# Altium schematic sheet C-07 CPU MISC.SchDoc
size 513 x 386 mm; Address1: 350W 9th Ave; Address2: Suite 206; Address3: Escondido CA 92025; Address4: United States; Revision: -; ENG_APP_DATE: --/--/--; DSN_APP_DATE: --/--/--; CHK_APP_DATE: --/--/--
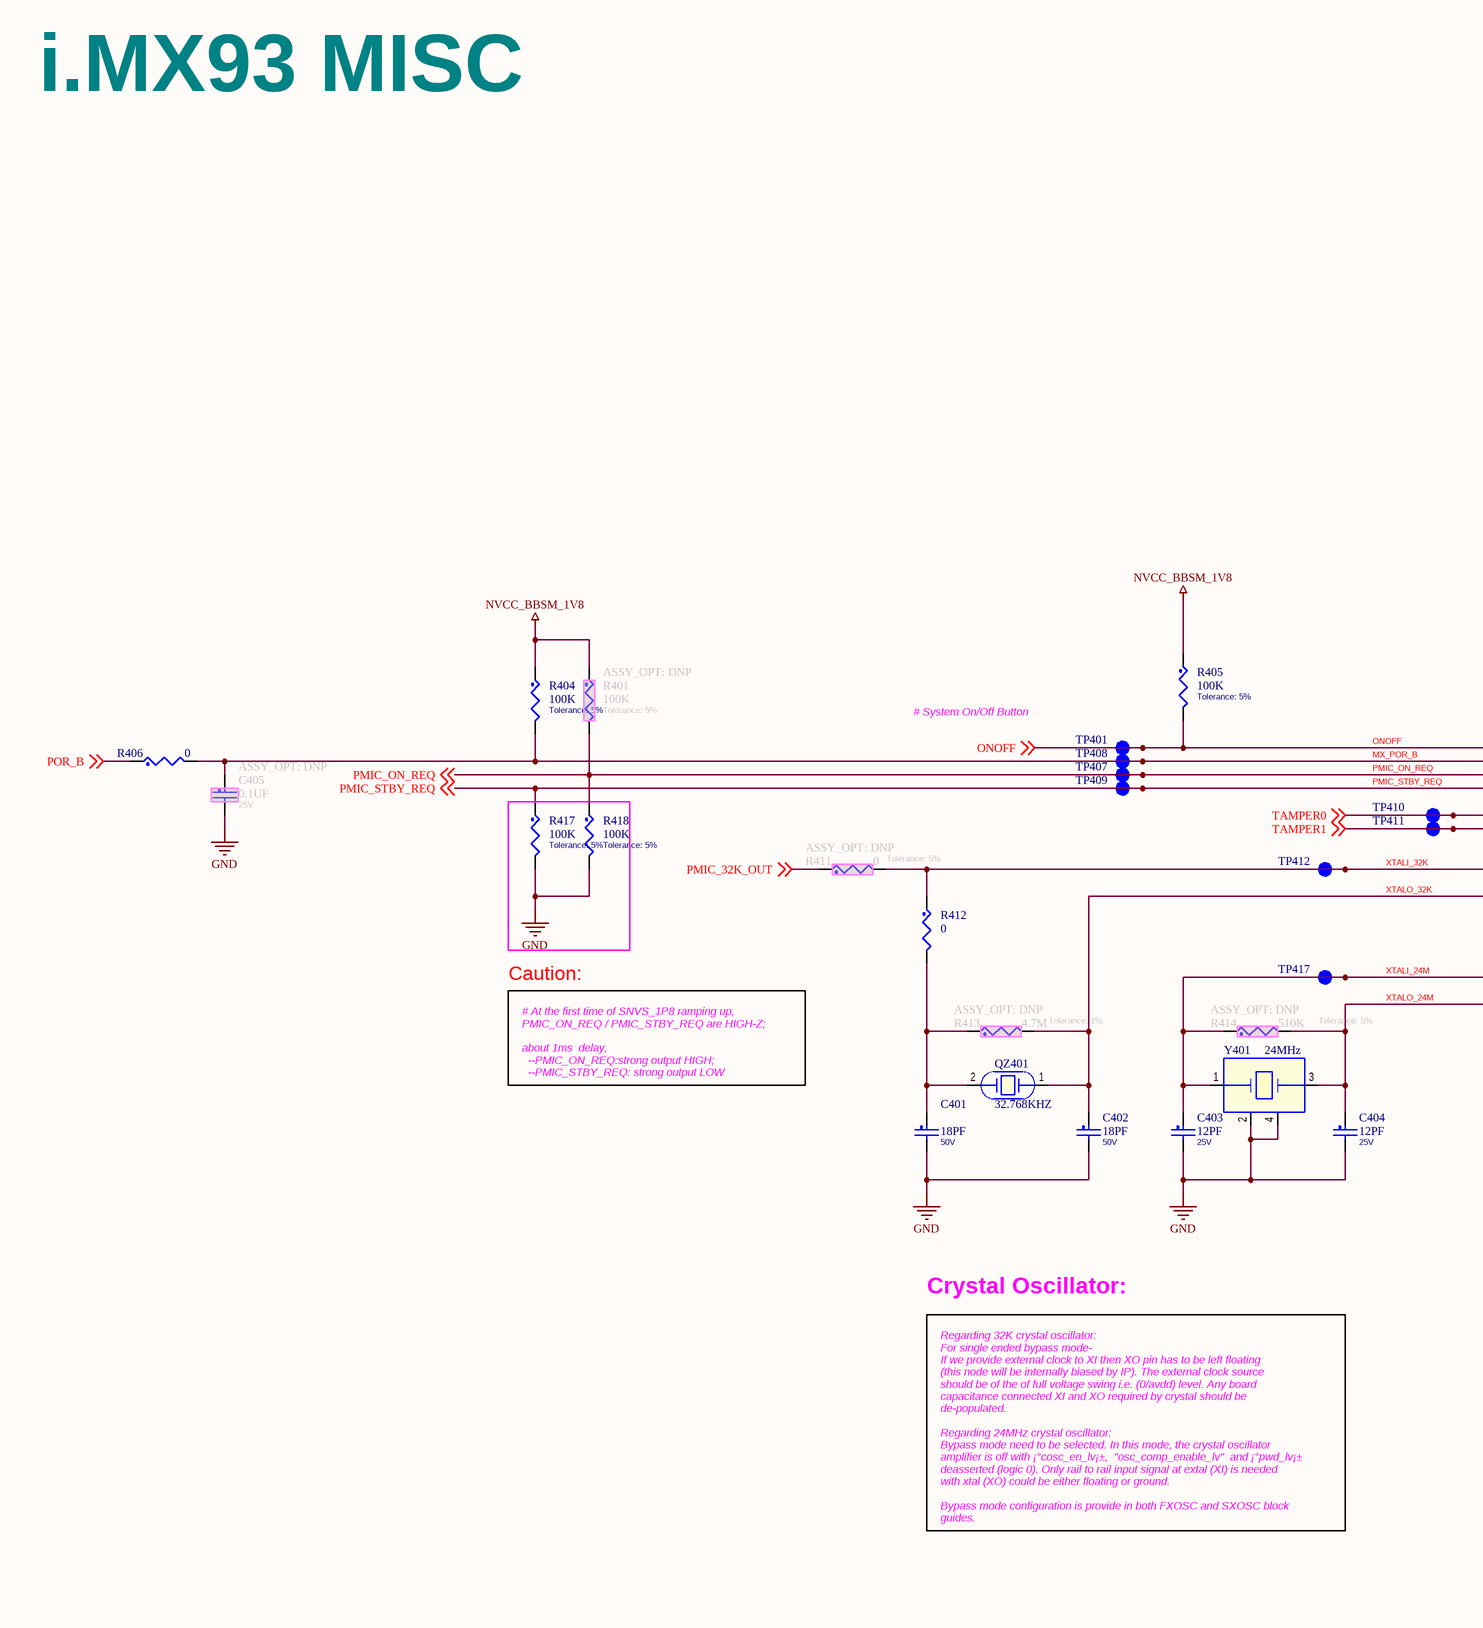
[diagram p0: C-07 CPU MISC.SchDoc, left]
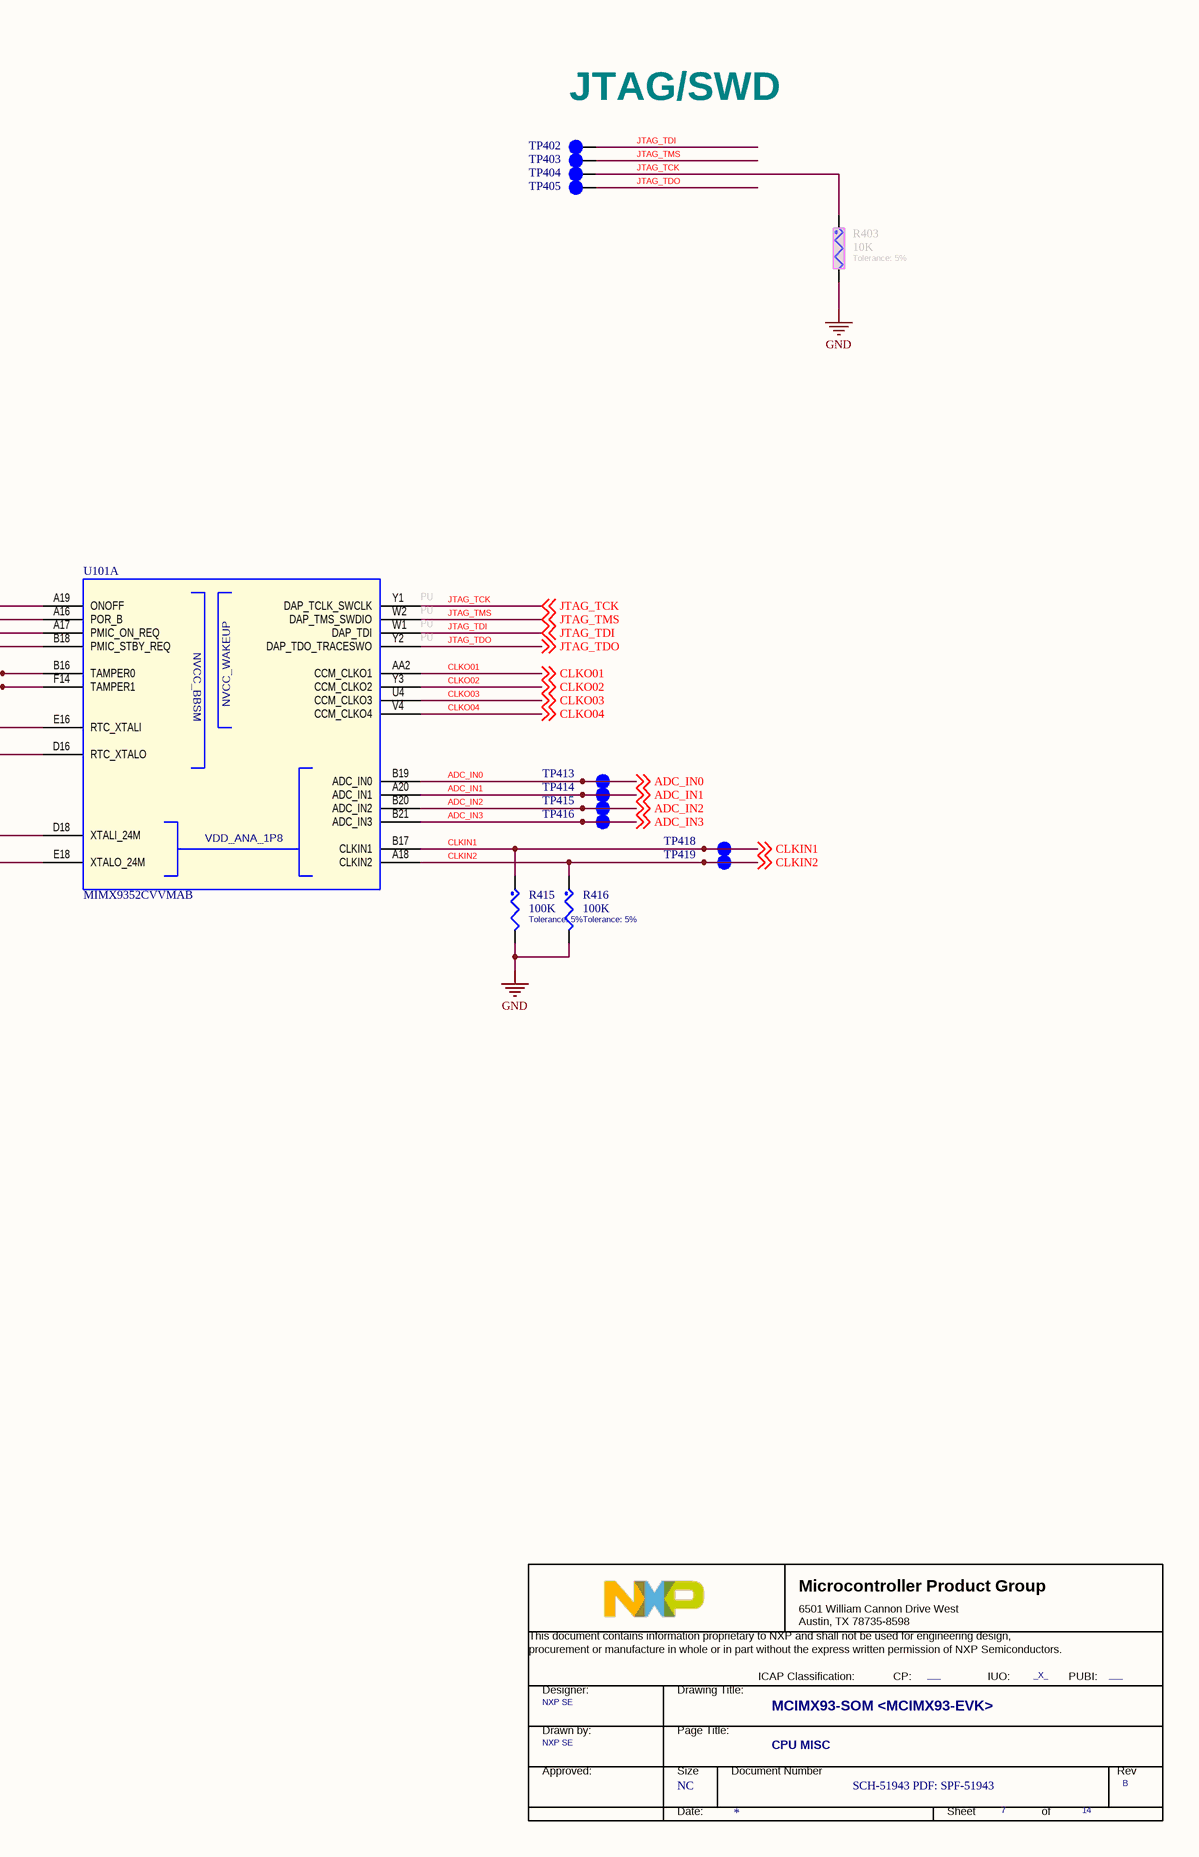
[diagram p1: C-07 CPU MISC.SchDoc, right]

## Parts
*  Doc: SCH-51943 PDF: SPF-51943  RevCode: B  Title: MCIMX93-SOM <MCIMX93-EVK>  Page Size: NC  Page Number: 7  Page Count: 14  PageTitle: CPU MISC  Designer: NXP SE  PUBI: ___  FIUO: _X_  (hidden comment: TitleBlock_MCPG)  (graphical)
C401  18PF  VOLTAGE: 50V  [0201_CC]
C402  18PF  VOLTAGE: 50V  [0201_CC]
C403  12PF  VOLTAGE: 25V  [0201_CC]
C404  12PF  VOLTAGE: 25V  [0201_CC]
C405  0.1UF  ASSY_OPT: DNP  VOLTAGE: 25V  [0402_CC]
QZ401  32.768KHZ  [XTAL2-3P2X1P5-SM]
R401  100K  ASSY_OPT: DNP  Tolerance: 5%  [0402_CC]
R403  10K  Tolerance: 5%  [0402_CC]
R404  100K  Tolerance: 5%  [0402_CC]
R405  100K  Tolerance: 5%  [0402_CC]
R406  0  [0201_CC]
R411  0  ASSY_OPT: DNP  Tolerance: 5%  [0201_CC]
R412  0  [0201_CC]
R413  4.7M  ASSY_OPT: DNP  Tolerance: 1%  [RC0402_25]
R414  510K  ASSY_OPT: DNP  Tolerance: 5%  [0402_CC]
R415  100K  Tolerance: 5%  [0402_CC]
R416  100K  Tolerance: 5%  [0402_CC]
R417  100K  Tolerance: 5%  [0402_CC]
R418  100K  Tolerance: 5%  [0402_CC]
TP401  tpad_020  [tpad_020]  (value not drawn)  (no BOM)
TP402  tpad_020  [tpad_020]  (value not drawn)  (no BOM)
TP403  tpad_020  [tpad_020]  (value not drawn)  (no BOM)
TP404  tpad_020  [tpad_020]  (value not drawn)  (no BOM)
TP405  tpad_020  [tpad_020]  (value not drawn)  (no BOM)
TP407  tpad_020  [tpad_020]  (value not drawn)  (no BOM)
TP408  tpad_020  [tpad_020]  (value not drawn)  (no BOM)
TP409  tpad_020  [tpad_020]  (value not drawn)  (no BOM)
TP410  tpad_020  [tpad_020]  (value not drawn)  (no BOM)
TP411  tpad_020  [tpad_020]  (value not drawn)  (no BOM)
TP412  TPAD_015  [TPAD_015]  (value not drawn)  (no BOM)
TP413  tpad_020  [tpad_020]  (value not drawn)  (no BOM)
TP414  tpad_020  [tpad_020]  (value not drawn)  (no BOM)
TP415  tpad_020  [tpad_020]  (value not drawn)  (no BOM)
TP416  tpad_020  [tpad_020]  (value not drawn)  (no BOM)
TP417  TPAD_015  [TPAD_015]  (value not drawn)  (no BOM)
TP418  tpad_020  [tpad_020]  (value not drawn)  (no BOM)
TP419  tpad_020  [tpad_020]  (value not drawn)  (no BOM)
U101  MIMX9352CVVMAB  [SKT_BGA306_0P5_SQ16P23_ELAST]  (part A of 6)
Y401  24MHz  [xtlosc4_3p2x2p5mm_sm]

## Nets
GND: C401.2 C402.2 C403.2 C404.2 C405.2 R403.2 R415.2 R416.2 R417.2 R418.2 Y401.2 Y401.4
NVCC_BBSM_1V8: R401.1 R404.1 R405.1
ADC_IN0: TP413.1(Pin1) U101.B19(ADC_IN0) ; off-sheet ADC_IN0
ADC_IN1: TP414.1(Pin1) U101.A20(ADC_IN1) ; off-sheet ADC_IN1
ADC_IN2: TP415.1(Pin1) U101.B20(ADC_IN2) ; off-sheet ADC_IN2
ADC_IN3: TP416.1(Pin1) U101.B21(ADC_IN3) ; off-sheet ADC_IN3
CLKIN1: R415.1 TP418.1(Pin1) U101.B17(CLKIN1) ; off-sheet CLKIN1
CLKIN2: R416.1 TP419.1(Pin1) U101.A18(CLKIN2) ; off-sheet CLKIN2
CLKO01: U101.AA2(CCM_CLKO1) ; off-sheet CLKO01
CLKO02: U101.Y3(CCM_CLKO2) ; off-sheet CLKO02
CLKO03: U101.U4(CCM_CLKO3) ; off-sheet CLKO03
CLKO04: U101.V4(CCM_CLKO4) ; off-sheet CLKO04
JTAG_TCK: R403.1 TP404.1(Pin1) U101.Y1(DAP_TCLK_SWCLK) ; off-sheet JTAG_TCK
JTAG_TDI: TP402.1(Pin1) U101.W1(DAP_TDI) ; off-sheet JTAG_TDI
JTAG_TDO: TP405.1(Pin1) U101.Y2(DAP_TDO_TRACESWO) ; off-sheet JTAG_TDO
JTAG_TMS: TP403.1(Pin1) U101.W2(DAP_TMS_SWDIO) ; off-sheet JTAG_TMS
MX_POR_B: C405.1 R404.2 R406.2 TP408.1(Pin1) U101.A16(POR_B)
ONOFF: R405.2 TP401.1(Pin1) U101.A19(ONOFF) ; off-sheet ONOFF
PMIC_32K_OUT: R411.1 ; off-sheet PMIC_32K_OUT
PMIC_ON_REQ: R401.2 R418.1 TP407.1(Pin1) U101.A17(PMIC_ON_REQ) ; off-sheet PMIC_ON_REQ
PMIC_STBY_REQ: R417.1 TP409.1(Pin1) U101.B18(PMIC_STBY_REQ) ; off-sheet PMIC_STBY_REQ
POR_B: R406.1 ; off-sheet POR_B
TAMPER0: TP410.1(Pin1) U101.B16(TAMPER0) ; off-sheet TAMPER0
TAMPER1: TP411.1(Pin1) U101.F14(TAMPER1) ; off-sheet TAMPER1
XTALI_24M: C403.1 R414.1 TP417.1(Pin1) U101.D18(XTALI_24M) Y401.1
XTALI_32K: R411.2 R412.1 TP412.1(Pin1) U101.E16(RTC_XTALI)
XTALO_24M: C404.1 R414.2 U101.E18(XTALO_24M) Y401.3
XTALO_32K: C402.1 QZ401.1 R413.2 U101.D16(RTC_XTALO)
NetC401_1: C401.1 QZ401.2 R412.2 R413.1

## Notes on the sheet
- i.MX93 MISC
- JTAG/SWD
- # System On/Off Button
- (near U101) PU
- Caution:
- # At the first time of SNVS_1P8 ramping up,
  PMIC_ON_REQ / PMIC_STBY_REQ are HIGH-Z;
  about 1ms  delay,
  --PMIC_ON_REQ:strong output HIGH;
  --PMIC_STBY_REQ: strong output LOW
- Crystal Oscillator:
- Regarding 32K crystal oscillator:
  For single ended bypass mode-
  If we provide external clock to XI then XO pin has to be left floating
  (this node will be internally biased by IP). The external clock source
  should be of the of full voltage swing i.e. (0/avdd) level. Any board
  capacitance connected XI and XO required by crystal should be
  de-populated.
  Regarding 24MHz crystal oscillator:
  Bypass mode need to be selected. In this mode, the crystal oscillator
  amplifier is off with ¡°cosc_en_lv¡±,  "osc_comp_enable_lv"  and ¡°pwd_lv¡±
  deasserted (logic 0). Only rail to rail input signal at extal (XI) is needed
  with xtal (XO) could be either floating or ground.
  Bypass mode configuration is provide in both FXOSC and SXOSC block
  guides.
- 8
- 7
- 6
- 5
- 4
- 3
- 2
- 1
- REVISION
- DESCRIPTION
- DATE
- APPROVED
- F
- E
- D
- C
- B
- PROJECT:
- REV.
- ENG:
- APPROVALS
- PROJECT
- JordanDSP LLC <https://www.jordandsp.com>
- Envision Excellence
- SHT.
- A
- DSN:
- CHK:
- REFERENCE ITEMS
- PRJ VCS REVISION:
- TITLE
- DOC VCS REVISION:
- MODIFIED DATE:
- BOM:
- FAB DWG:
- FIRMWARE:
- ASSY DWG:
- SCALE:
- SIZE
- CAGE CODE
- FILE NAME
- DWG NO.
- PAGE
- PRODUCT REV
- OF
- (in symbol MIMX9352DVNxLAA, part A) NVCC_BBSM; NVCC_WAKEUP; VDD_ANA_1P8
- (in symbol TitleBlock_MCPG) Microcontroller Product Group; 6501 William Cannon Drive West / Austin, TX 78735-8598; This document contains information proprietary to NXP and shall not be used for engineering design,; procurement or manufacture in whole or in part without the express written permission of NXP Semiconductors.; ICAP Classification:; CP:; IUO:; PUBI:; Designer:; Drawing Title:; Drawn by:; Page Title:; Approved:; Size; Document Number; Rev; Date:; Sheet; of

## Library data of the parts
* = TitleBlock_MCPG: OrgName: NXP Semiconductor; OrgAddr1: NO. 192 Liangjing Rd. Pudong New Area, ShangHai; Page Create Date: March  8, 1995; DrawnBy: NXP SE; FCP: ___; Page Modify Date: *
C401 = CAP_NP: CAP CER 18pF 50V 5% C0G 0201; CLASS: DISCRETE; FPLIST: CC0201,CC0201_HD,0201_CC; CAD_APPROVED: Yes; MFG_PN01: GRM0335C1H180JA01D; MFG_NAME01: MURATA; AGILE_PN: 150-79476; Package Type: &#966;180mm Paper taping; Package Size: 0201; HEIGHT: 0.33MM; ROHS: Yes; Tolerance: 5%; PCB Footprint: 0201_CC
C402 = CAP_NP: CAP CER 18pF 50V 5% C0G 0201; CLASS: DISCRETE; AGILE_PN: 150-79476; MFG_NAME01: MURATA; MFG_PN01: GRM0335C1H180JA01D; CAD_APPROVED: Yes; FPLIST: CC0201,CC0201_HD,0201_CC; Package Type: &#966;180mm Paper taping; Package Size: 0201; Tolerance: 5%; ROHS: Yes; HEIGHT: 0.33MM; PCB Footprint: 0201_CC
C403 C404 = CAP_NP: CAP CER 12PF 25V 5% C0G AEC-Q200 0201; CLASS: DISCRETE; AGILE_PN: 150-79813; MFG_NAME01: TDK; MFG_PN01: CGA1A2C0G1E120J030BA; CAD_APPROVED: Yes; FPLIST: CC0201,CC0201_HD,0201_CC; Tolerance: 5%; ROHS: Yes; HEIGHT: 0.33MM; PCB Footprint: 0201_CC
C405 = CAP_NP: CAP CER 0.1UF 25V 10% X5R 0402; CLASS: DISCRETE; FPLIST: CC0402_25,CC0402_HD,0402_CC; CAD_APPROVED: Yes; MFG_PN01: CC0402KRX5R8BB104; MFG_NAME01: YAGEO AMERICA; AGILE_PN: 150-78633; HEIGHT: 0.55MM; ROHS: Yes; Tolerance: 10%; Package Size: 0402; PCB Footprint: 0402_CC
QZ401 = XTAL: XTAL 32.768KHZ 12.5PF 20PPM 3.2X1.5MM SMT; CLASS: IC; AGILE_PN: 230-77653; MFG_NAME01: Abracon Corporation; MFG_PN01: ABS07-32.768KHZ-T; CAD_APPROVED: Yes; ROHS: Yes; HEIGHT: 0.9MM; PCB Footprint: XTAL2-3P2X1P5-SM
R401 R405 R415-R418 = RES: RES MF 100K 1/16W 5% 0402; CLASS: DISCRETE; Temp Range: -55C to +155C; VOLTAGE: 50V; AGILE_PN: 470-75597; MFG_NAME01: VENKEL COMPANY; MFG_PN01: CR0402-16W-104JT; CAD_APPROVED: Yes; FPLIST: RC0402_25,RC0402_HD,0402_CC; ROHS: Yes; HEIGHT: 0.40 MM; PCB Footprint: 0402_CC
R403 = RES: RES MF 10K 1/16W 5% 0402; CLASS: DISCRETE; AGILE_PN: 470-75557; MFG_NAME01: VISHAY INTERTECHNOLOGY; MFG_PN01: CRCW040210K0JNED; CAD_APPROVED: Yes; FPLIST: RC0402_25,RC0402_HD,0402_CC; PCB Footprint: 0402_CC; ROHS: Yes; HEIGHT: 0.4 MM
R404 = RES: RES MF 100K 1/16W 5% 0402; CLASS: DISCRETE; FPLIST: RC0402_25,RC0402_HD,0402_CC; CAD_APPROVED: Yes; MFG_PN01: CR0402-16W-104JT; MFG_NAME01: VENKEL COMPANY; AGILE_PN: 470-75597; VOLTAGE: 50V; Temp Range: -55C to +155C; HEIGHT: 0.40 MM; ROHS: Yes; PCB Footprint: 0402_CC
R406 R412 = RES: RES MF ZERO OHM 1/20W -- 0201; CLASS: DISCRETE; AGILE_PN: 470-76631; MFG_NAME01: BOURNS; MFG_PN01: CR0201-J/-000GLF; CAD_APPROVED: Yes; FPLIST: RC0201,0201_CC,RC0201_X2; ROHS: Yes; HEIGHT: 0.30 MM; PCB Footprint: 0201_CC
R411 = RES: RES MF ZERO OHM 1/20W -- 0201; CLASS: DISCRETE; FPLIST: RC0201,0201_CC,RC0201_X2; CAD_APPROVED: Yes; MFG_PN01: CR0201-J/-000GLF; MFG_NAME01: BOURNS; AGILE_PN: 470-76631; HEIGHT: 0.30 MM; ROHS: Yes; PCB Footprint: 0201_CC
R413 = RES: RES MF 4.7M  1/16W 1% 0402; CLASS: DISCRETE; AGILE_PN: 470-31250; FPLIST: RC0402_25,RC0402_HD,0402_CC; CAD_APPROVED: Yes; VOLTAGE: 50V; Temp Range: -55¡ãC ~ 155¡ãC; MFG_NAME01: YAGEO AMERICA; MFG_PN01: RC0402FR-074M7L; HEIGHT: 0.40 MM; ROHS: Yes; PCB Footprint: RC0402_25
R414 = RES: RES MF 510K 1/16W 5% 0402; CLASS: DISCRETE; FPLIST: RC0402_25,RC0402_HD,0402_CC; CAD_APPROVED: Yes; MFG_PN01: ERJ-2GEJ514X; MFG_NAME01: PANASONIC; AGILE_PN: 470-76166; HEIGHT: 0.4 MM; ROHS: Yes; PCB Footprint: 0402_CC
TP401 TP402 TP404 TP409-TP411 TP413 TP415 TP419 = TESTLOOP: TEST POINT PAD 0.5MM DIA SMT, NO PART TO ORDER; ASSY_OPT: DNP; CLASS: IO; AGILE_PN: 211-77484; CAD_APPROVED: Yes; ROHS: Yes; HEIGHT: 0.1MM; PCB Footprint: tpad_020
TP403 TP405 TP407 TP408 TP414 TP416 TP418 = TESTLOOP: TEST POINT PAD 0.5MM DIA SMT, NO PART TO ORDER; ASSY_OPT: DNP; CLASS: IO; CAD_APPROVED: Yes; AGILE_PN: 211-77484; PCB Footprint: tpad_020; HEIGHT: 0.1MM; ROHS: Yes
TP412 = TESTLOOP: TEST POINT PAD 15MIL DIA SMT, NO PART TO ORDER; ASSY_OPT: DNP; CLASS: IO; AGILE_PN: 211-76645; MFG_NAME01: NOTACOMPONENT; CAD_APPROVED: Yes; MFG_PN01: NOTACOMPONENT; ROHS: Yes; HEIGHT: 0.1MM; PCB Footprint: TPAD_015
TP417 = TESTLOOP: TEST POINT PAD 15MIL DIA SMT, NO PART TO ORDER; ASSY_OPT: DNP; CLASS: IO; CAD_APPROVED: Yes; MFG_PN01: NOTACOMPONENT; AGILE_PN: 211-76645; HEIGHT: 0.1MM; ROHS: Yes; MFG_NAME01: NOTACOMPONENT; PCB Footprint: TPAD_015
U101 = MIMX9352DVNxLAA: SUBASSEMBLY SKT 306 BGA ELASTOMER SMT 0.5MM 395H AU + IC CPU 1.7GHz -- FCBGA306; MFG_PN01: 211-81728,330-77207; CAD_APPROVED: Yes; FPLIST: skt_bga306_0p5_sq16p23_elast,skt_bga306_0p5_sq16p23_elast_nsp; AGILE_PN: 750-78710; PCB Footprint: skt_bga306_0p5_sq16p23_elast_nsp; CLASS: IC; MFG_NAME01: SUBASSEMBLY; ROHS: Yes; HEIGHT: 10.03MM; Manufacturer Part Number: MIMX9352CVVMAB
Y401 = XTAL_13: XTAL 24MHZ 9pF -- SMT 3.2X2.5MM; CLASS: IC; AGILE_PN: 230-77392; MFG_NAME01: EPSON TOYOCOM CORPORATION; MFG_PN01: TSX-3225 24.0000MF15X-AC3; CAD_APPROVED: Yes; ROHS: Yes; HEIGHT: 0.60MM; PCB Footprint: xtlosc4_3p2x2p5mm_sm